# EAGLE design openbridge (EAGLE 9.6.2)
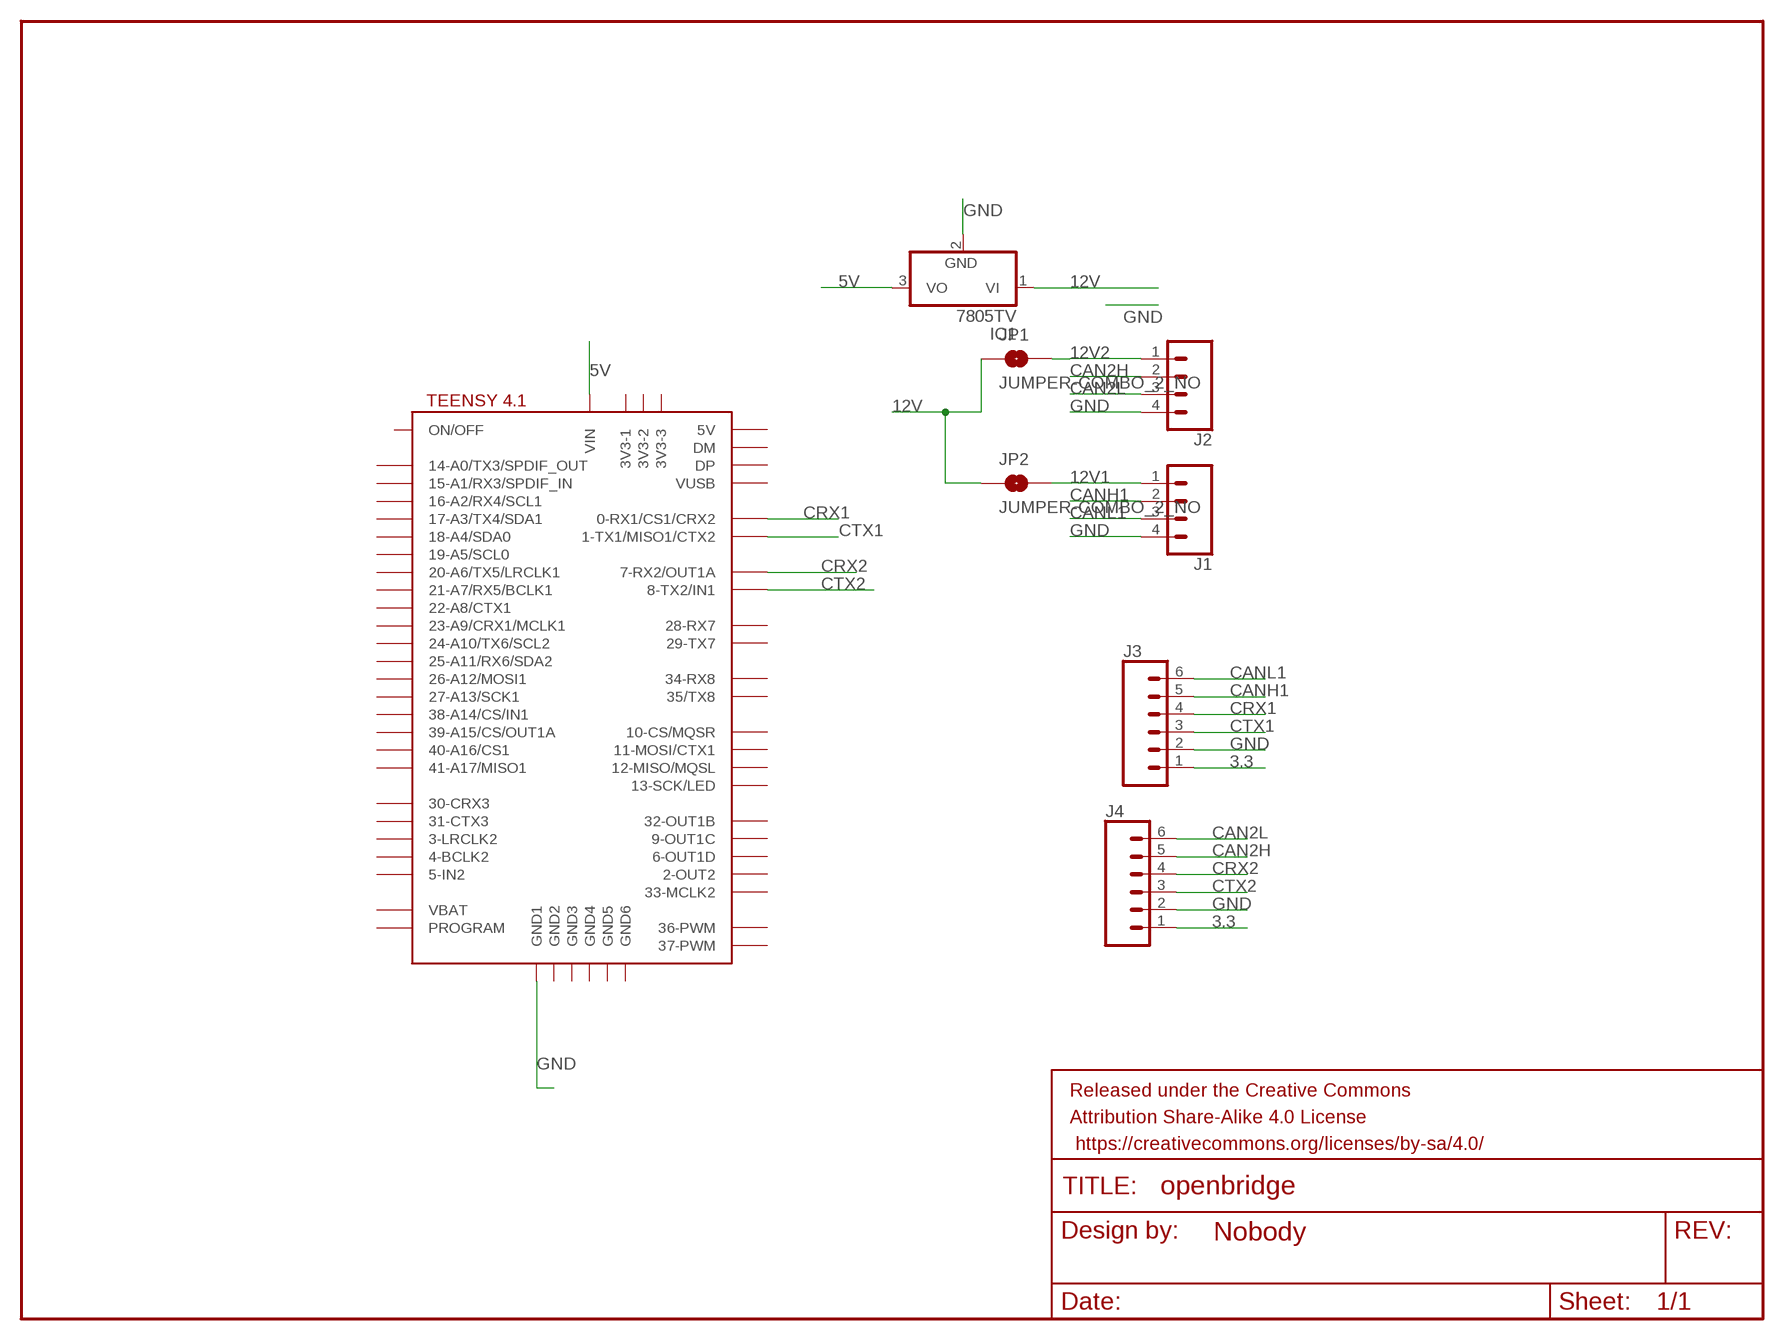
[diagram p0: schematic, sheet 1]

## Parts
FRAME1  FRAME-LETTERNO_PACKAGE  [DUMMY]
IC1  7805TV  [TO220V]
J1  CONN_04SCREW  [SCREWTERMINAL-3.5MM-4]
J2  CONN_04SCREW  [SCREWTERMINAL-3.5MM-4]
J3  CONN_06LONGPADS  [1X06_LONGPADS]
J4  CONN_06LONGPADS  [1X06_LONGPADS]
JP1  JUMPER-COMBO_2_NO  [COMBO-JUMPER_2_NO]
JP2  JUMPER-COMBO_2_NO  [COMBO-JUMPER_2_NO]
U$1  TEENSY41-E  [TENNSY41-E]

## Nets
3.3: J3.1 J4.1
5V: IC1.3(VO) U$1.VIN
12V: IC1.1(VI) JP1.1 JP1.3 JP2.1 JP2.3
12V1: J1.1 JP2.2 JP2.4
12V2: J2.1 JP1.2 JP1.4
CAN2H: J2.2 J4.5
CAN2L: J2.3 J4.6
CANH1: J1.2 J3.5
CANL1: J1.3 J3.6
CRX1: J3.4 U$1.0-RX1/CS1/CRX2
CRX2: J4.4 U$1.7-RX2/OUT1A
CTX1: J3.3 U$1.1-TX1/MISO1/CTX2
CTX2: J4.3 U$1.8-TX2/IN1
GND: IC1.2(GND) J1.4 J2.4 J3.2 J4.2 U$1.GND1
Unconnected: U$1.2-OUT2 U$1.3-LRCLK2 U$1.3V3-1 U$1.3V3-2 U$1.3V3-3 U$1.4-BCLK2 U$1.5-IN2 U$1.6-OUT1D U$1.9-OUT1C U$1.10-CS\MQSR(10-CS/MQSR) U$1.11-MOSI/CTX1 U$1.12-MISO/MQSL U$1.13-SCK/LED U$1.14-A0/TX3/SPDIF_OUT U$1.15-A1/RX3/SPDIF_IN U$1.16-A2/RX4/SCL1 U$1.17-A3/TX4/SDA1 U$1.18-A4/SDA0 U$1.19-A5/SCL0 U$1.20-A6/TX5/LRCLK1 U$1.21-A7/RX5/BCLK1 U$1.22-A8/CTX1 U$1.23-A9/CRX1/MCLK1 U$1.24-A10/TX6/SCL2 U$1.25-A11/RX6/SDA2 U$1.26-A12/MOSI1 U$1.27-A13/SCK1 U$1.28-RX7 U$1.29-TX7 U$1.30-CRX3 U$1.31-CTX3 U$1.32-OUT1B U$1.33-MCLK2 U$1.34-RX8 U$1.35-TX8(35/TX8) U$1.36-PWM U$1.37-PWM U$1.38-A14/CS/IN1 U$1.39-A15/CS/OUT1A U$1.40-A16/CS1 U$1.41-A17/MISO1 U$1.+5V(5V) U$1.DM U$1.DP U$1.GND2 U$1.GND3 U$1.GND4 U$1.GND5 U$1.GND6 U$1.ON/OFF U$1.PROGRAM U$1.VBAT U$1.VUSB

## Library data of the parts
FRAME1 = SparkFun-Aesthetics:FRAME-LETTER: Schematic Frame - Letter Standard 8.5x11 US Letter frame; DESIGNER: Nobody; VERSION: v01
IC1 = linear:78*: Positive VOLTAGE REGULATOR Source: http://cache.national.com/ds/LM/LM78L05.pdf http://www.fairchildsemi.com/ds/LM/LM7805.pdf
J1 J2 = SparkFun-Connectors:CONN_04: Multi connection point. Often used as Generic Header-pin footprint for 0.1 inch spaced/style header connections On any of the 0.1 inch spaced packages, you can populate with these: Break Away Headers - Straight <https://www.sparkfun.com/products/116> (PRT-00116) Break Away Male Headers - Right Angle <https://www.sparkfun.com/products/553> (PRT-00553) Female Headers <https://www.sparkfun.com/products/115> (PRT-00115) Break Away Headers - Machine Pin <https://www.sparkfun.com/products/117> (PRT-00117) Break Away Female Headers - Swiss Machine Pin <https://www.sparkfun.com/products/743> (PRT-00743) For SCREWTERMINALS and SPRING TERMINALS visit here: Screw Terimnals on SparkFun.com <https://www.sparkfun.com/search/results?term=Screw+Terminals> (5mm/3.5mm/2.54mm spacing) This device is also useful as a general connection point to wire up your design to another part of your project. Our various solder wires solder well into these plated through hole pads. Hook-Up Wire - Assortment (Stranded, 22 AWG) <https://www.sparkfun.com/products/11375> (PRT-11375) Hook-Up Wire - Assortment (Solid Core, 22 AWG) <https://www.sparkfun.com/products/11367> (PRT-11367) View the entire wire category on our website here <https://www.sparkfun.com/categories/141> Special notes: Molex polarized connector foot print use with SKU : PRT-08231 with associated crimp pins and housings. 1MM SMD Version SKU: PRT-10208; PROD_ID: CONN-14485
J3 J4 = SparkFun-Connectors:CONN_06: Multi connection point. Often used as Generic Header-pin footprint for 0.1 inch spaced/style header connections On any of the 0.1 inch spaced packages, you can populate with these: Break Away Headers - Straight <https://www.sparkfun.com/products/116> (PRT-00116) Break Away Male Headers - Right Angle <https://www.sparkfun.com/products/553> (PRT-00553) Female Headers <https://www.sparkfun.com/products/115> (PRT-00115) Break Away Headers - Machine Pin <https://www.sparkfun.com/products/117> (PRT-00117) Break Away Female Headers - Swiss Machine Pin <https://www.sparkfun.com/products/743> (PRT-00743) Arduino Stackable Header - 6 Pin <https://www.sparkfun.com/products/9280> (PRT-09280) For SCREWTERMINALS and SPRING TERMINALS visit here: Screw Terimnals on SparkFun.com <https://www.sparkfun.com/search/results?term=Screw+Terminals> (5mm/3.5mm/2.54mm spacing) This device is also useful as a general connection point to wire up your design to another part of your project. Our various solder wires solder well into these plated through hole pads. Hook-Up Wire - Assortment (Stranded, 22 AWG) <https://www.sparkfun.com/products/11375> (PRT-11375) Hook-Up Wire - Assortment (Solid Core, 22 AWG) <https://www.sparkfun.com/products/11367> (PRT-11367) View the entire wire category on our website here <https://www.sparkfun.com/categories/141>
JP1 JP2 = SparkFun-Jumpers:JUMPER-COMBO_2_NO
U$1 = teensy41:TEENSY41-E

## Board
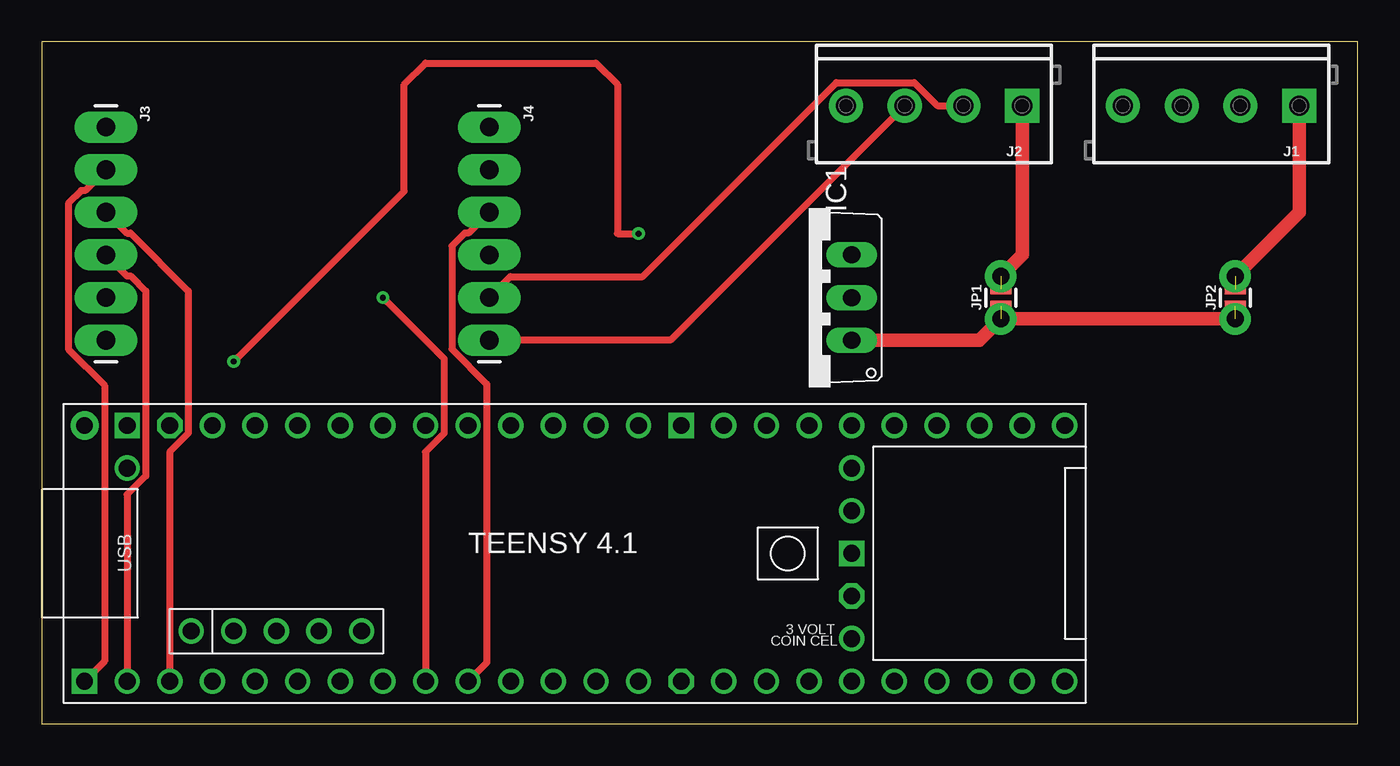
[diagram p1: board, top side]
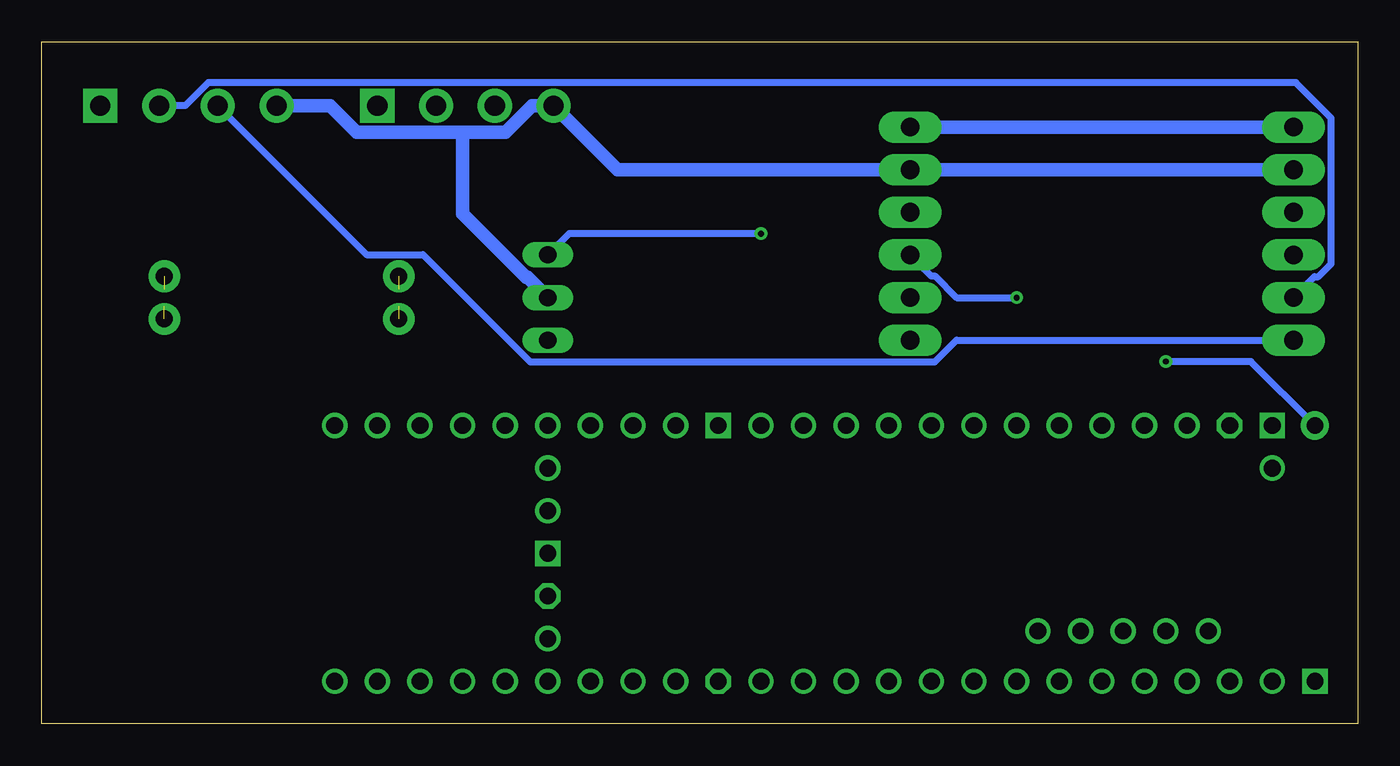
[diagram p2: board, bottom side, seen from below]

Size 78.41 x 40.63 mm. Coordinates in mm from the lower left corner, seen from the top.
Outline: 0,0 78.41,0 78.41,40.63 0,40.63 0,0
Copper layers (1*16): Top 0.035mm / dielectric 1.5mm / Bottom 0.035mm
Design rules "default": minimum track width 6mil, minimum drill 0.35mm, track to track 6mil, track to pad 6mil, pad to pad 6mil, via to via 6mil, smd to smd 6mil, copper to edge 40mil, drill to drill 6mil, minimum pad ring 10mil, minimum via ring 8mil, stop-mask expansion 4mil, vias tented up to drill 0mil, thermal gap 10mil

### Footprints (pad centres in the part's own frame; a part is rotated, then mirrored left to right if it is on the bottom)
TO220V = drill 1.016 long: 1 -2.54,-2.54; 2 0,-2.54; 3 2.54,-2.54
SCREWTERMINAL-3.5MM-4 = drill 1.2 pad 2.032 square: 1 0,0 | drill 1.2 pad 2.032: 2 3.5,0; 3 7,0; 4 10.5,0
1X06_LONGPADS = drill 1.118 pad 1.88 long: 1 0,0; 2 2.54,0; 3 5.08,0; 4 7.62,0; 5 10.16,0; 6 12.7,0
COMBO-JUMPER_2_NO = smd 0.635 x 1.27: 1 -0.508,0; 2 0.508,0 | drill 1.016 pad 1.88: 3 -1.27,0; 4 1.27,0
TENNSY41-E = drill 1: 0-RX1/CS1/CRX2 -27.94,-7.62; 1-TX1/MISO1/CTX2 -25.4,-7.62; 2-OUT2 -22.86,-7.62; 3-LRCLK2 -20.32,-7.62; 4-BCLK2 -17.78,-7.62; 5-IN2 -15.24,-7.62; 6-OUT1D -12.7,-7.62; 7-RX2/OUT1A -10.16,-7.62; 8-TX2/IN1 -7.62,-7.62; 9-OUT1C -5.08,-7.62; 10-CS\MQSR -2.54,-7.62; 11-MOSI/CTX1 0,-7.62; 12-MISO/MQSL 2.54,-7.62; 13-SCK/LED 2.54,7.62; 14-A0/TX3/SPDIF_OUT 0,7.62; 15-A1/RX3/SPDIF_IN -2.54,7.62; 16-A2/RX4/SCL1 -5.08,7.62; 17-A3/TX4/SDA1 -7.62,7.62; 18-A4/SDA0 -10.16,7.62; 19-A5/SCL0 -12.7,7.62; 20-A6/TX5/LRCLK1 -15.24,7.62; 21-A7/RX5/BCLK1 -17.78,7.62; 22-A8/CTX1 -20.32,7.62; 23-A9/CRX1/MCLK1 -22.86,7.62; 24-A10/TX6/SCL2 7.62,-7.62; 25-A11/RX6/SDA2 10.16,-7.62; 26-A12/MOSI1 12.7,-7.62; 27-A13/SCK1 15.24,-7.62; 28-RX7 17.78,-7.62; 29-TX7 20.32,-7.62; 30-CRX3 22.86,-7.62; 31-CTX3 25.4,-7.62; 32-OUT1B 27.94,-7.62; 33-MCLK2 27.94,7.62; 34-RX8 25.4,7.62; 35-TX8 22.86,7.62; 36-PWM 20.32,7.62; 37-PWM 17.78,7.62; 38-A14/CS/IN1 15.24,7.62; 39-A15/CS/OUT1A 12.7,7.62; 40-A16/CS1 10.16,7.62; 41-A17/MISO1 7.62,7.62; +5V -24.13,-4.62; DM -21.59,-4.62; DP -19.05,-4.62; GND4 -16.51,-4.62; GND5 -13.97,-4.62; ON/OFF 15.24,5.08; PROGRAM 15.24,2.54; VBAT 15.24,-5.08; VUSB -27.94,5.08 | drill 1 octagon: 3V3-1 5.08,-7.62; 3V3-2 15.24,-2.54; 3V3-3 -25.4,7.62 | drill 1 square: GND1 -30.48,-7.62; GND2 15.24,0; GND3 5.08,7.62; GND6 -27.94,7.62 | drill 1 pad 1.676: VIN -30.48,7.62

### Placement (x,y rotation side)
FRAME1  -6.35,-8.89 0 top  (outside the outline)
IC1  45.72,25.4 90 top
J1  74.93,36.83 180 top
J2  58.42,36.83 180 top
J3  3.81,35.56 270 top
J4  26.67,35.56 270 top
JP1  57.15,25.4 90 top
JP2  71.12,25.4 90 top
U$1  33.02,10.16 0 top

### Tracks (layer width: path | path; a pad name or v marks a point on that pad's centre or on a via)
3.3
  Bottom 0.813: J3.1 J4.1
5V  (via drill 0.35)
  Top 0.406: v11.43,21.59 21.59,31.75 21.59,38.1 22.86,39.37 33.02,39.37 34.29,38.1 34.29,29.21 v35.56,29.21
  Bottom 0.406: U$1.VIN 6.35,21.59 v11.43,21.59 | v35.56,29.21 46.99,29.21 IC1.3
12V  (2 unrouted)
  Top 0.813: JP2.3 JP1.3 55.88,22.86 IC1.1
12V1  (1 unrouted)
  Top 0.813: JP2.4 74.93,30.48 J1.1
12V2  (1 unrouted)
  Top 0.813: JP1.4 58.42,27.94 J2.1
CAN2H
  Top 0.406: J4.5 27.91,26.64 35.8,26.64 47.35,38.2 51.99,38.2 53.36,36.83 J2.2
CAN2L
  Top 0.406: J2.3 37.45,22.86 J4.6
CANH1
  Bottom 0.406: J3.5 2.56,26.64 2.33,26.64 1.57,27.4 1.57,36.1 3.68,38.2 68.5,38.2 69.87,36.83 J1.2
CANL1
  Bottom 0.406: J1.3 59.06,27.96 55.71,27.96 49.31,21.57 25.19,21.57 23.9,22.86 J3.6
CRX1
  Top 0.406: J3.4 5.05,26.7 5.29,26.7 6.19,25.79 6.19,14.78 5.08,13.67 U$1.0-RX1/CS1/CRX2
CRX2  (via drill 0.35)
  Top 0.406: U$1.7-RX2/OUT1A 22.86,16.21 23.97,17.32 23.97,21.75 v20.32,25.4
  Bottom 0.406: J4.4 25.43,26.7 25.19,26.7 23.9,25.4 v20.32,25.4
CTX1
  Top 0.406: J3.3 5.05,29.23 5.29,29.23 8.73,25.79 8.73,17.32 7.62,16.21 U$1.1-TX1/MISO1/CTX2
CTX2
  Top 0.406: J4.3 25.43,29.23 25.19,29.23 24.43,28.48 24.43,22.32 26.51,20.25 26.51,3.65 U$1.8-TX2/IN1
GND
  Top 0.406: J3.2 2.56,31.77 2.33,31.77 1.57,31.02 1.57,22.32 3.73,20.16 3.73,3.73 U$1.GND1
  Bottom 0.508: J3.2 15.24,33.02
  Bottom 0.813: J1.4 61.24,36.83 59.67,35.26 53.34,35.26 | 53.34,35.26 50.77,35.26 49.19,36.83 J2.4 44.11,33.02 J4.2 J3.2 | IC1.2 49.48,26.62 49.57,26.62 53.34,30.39 53.34,35.26